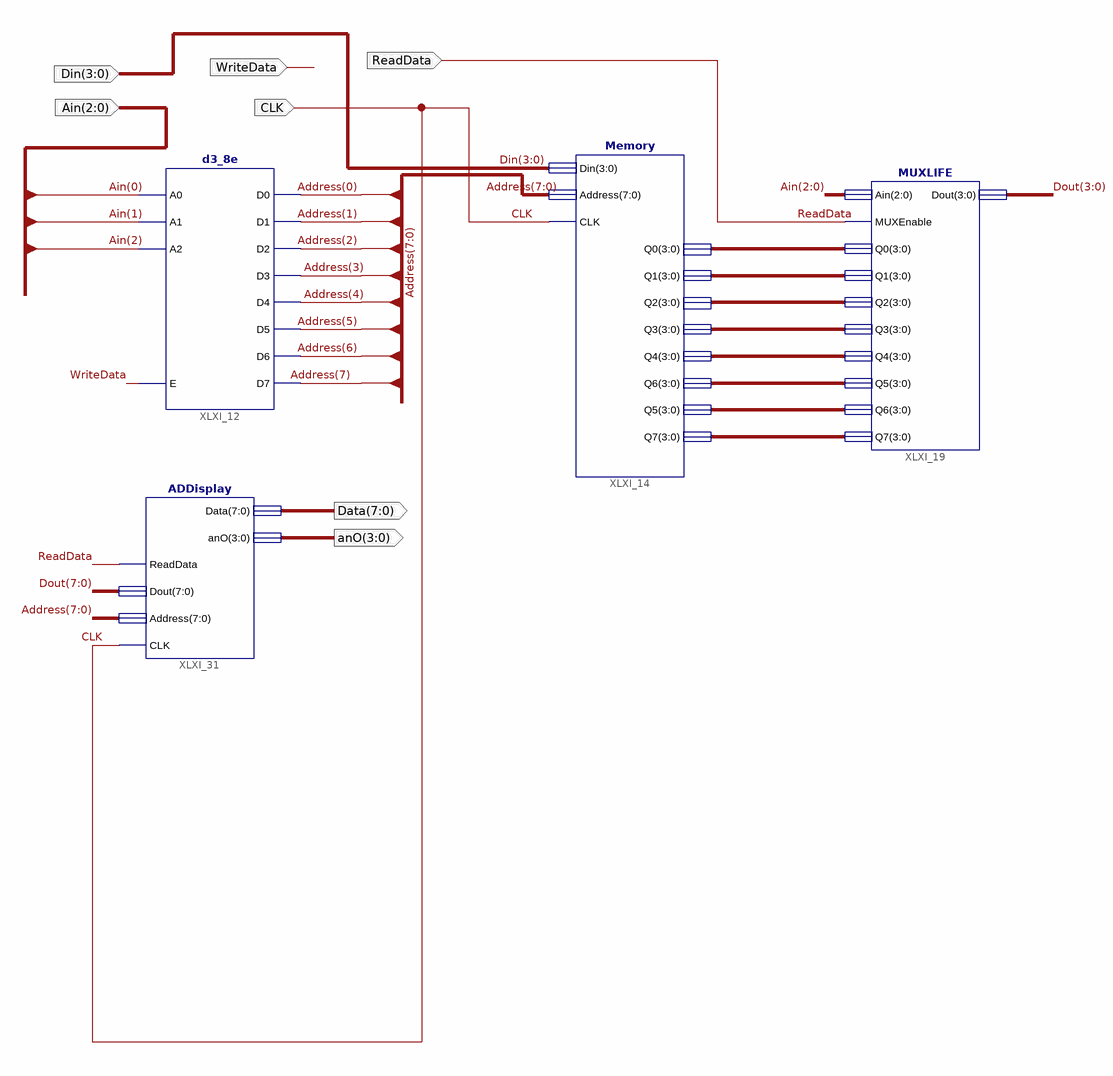
[diagram p0: schematic sheet 1]
// Xilinx ISE schematic Exp10.sch (spartan3e) as structural Verilog: 4 symbols, 7 ports
module Exp10 (
  input  [3:0] Din,
  input  [2:0] Ain,
  input  WriteData,
  input  CLK,
  input  ReadData,
  output [7:0] Data,
  output [3:0] anO
);

  wire [3:0] XLXN_32, XLXN_33, XLXN_34, XLXN_35, XLXN_37, XLXN_38, XLXN_39, XLXN_40;
  wire [7:0] Address, Dout;

  d3_8e XLXI_12 (
    .A0(Ain[0]), .A1(Ain[1]), .A2(Ain[2]), .E(WriteData), .D0(Address[0]), .D1(Address[1]), .D2(Address[2]),
    .D3(Address[3]), .D4(Address[4]), .D5(Address[5]), .D6(Address[6]), .D7(Address[7]));
  Memory XLXI_14 (
    .Din(Din), .Address(Address), .CLK(CLK), .Q1(XLXN_33), .Q3(XLXN_35), .Q4(XLXN_37), .Q6(XLXN_38),
    .Q5(XLXN_39), .Q7(XLXN_40), .Q2(XLXN_34), .Q0(XLXN_32));
  MUXLIFE XLXI_19 (
    .Ain(Ain), .MUXEnable(ReadData), .Q0(XLXN_32), .Q1(XLXN_33), .Q2(XLXN_34), .Q3(XLXN_35), .Q4(XLXN_37),
    .Q5(XLXN_38), .Q6(XLXN_39), .Q7(XLXN_40), .Dout(Dout[3:0]));
  ADDisplay XLXI_31 (.ReadData(ReadData), .Dout(Dout), .Address(Address), .Data(Data), .anO(anO), .CLK(CLK));
endmodule
